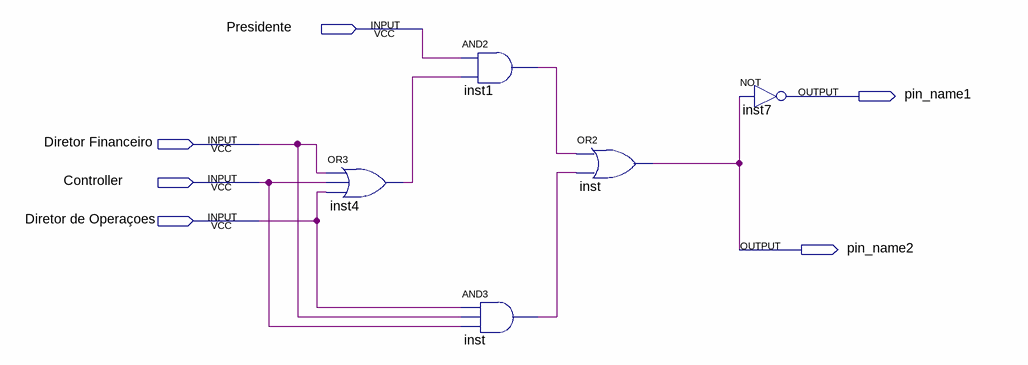
[diagram p0: schematic sheet]
// Quartus schematic Projeto.bdf as structural Verilog: 5 symbols, 6 pins
module Projeto (
  input  Presidente,
  input  \Diretor_Financeiro ,
  input  Controller,
  input  \Diretor_de_Operaçoes ,
  output pin_name1,
  output pin_name2
);

  wire inst1_out, inst4_out, inst_out;

  or inst4 (inst4_out, \Diretor_Financeiro , Controller, \Diretor_de_Operaçoes );
  and inst1 (inst1_out, Presidente, inst4_out);
  and inst (inst_out, \Diretor_de_Operaçoes , \Diretor_Financeiro , Controller);
  or inst_dup2 (pin_name2, inst1_out, inst_out);
  not inst7 (pin_name1, pin_name2);
endmodule
